# EasyEDA Pro project dual_dcdc_converter.eprj

# Schematic Schematic1
Create Date: 2024-04-01; Page Name: P1; Project Name: dual_dcdc_converter; Schematic Name: Schematic1; Update Date: 2024-04-03; Company: 嘉立创EDA; Page Size: A4; Version: V1.0
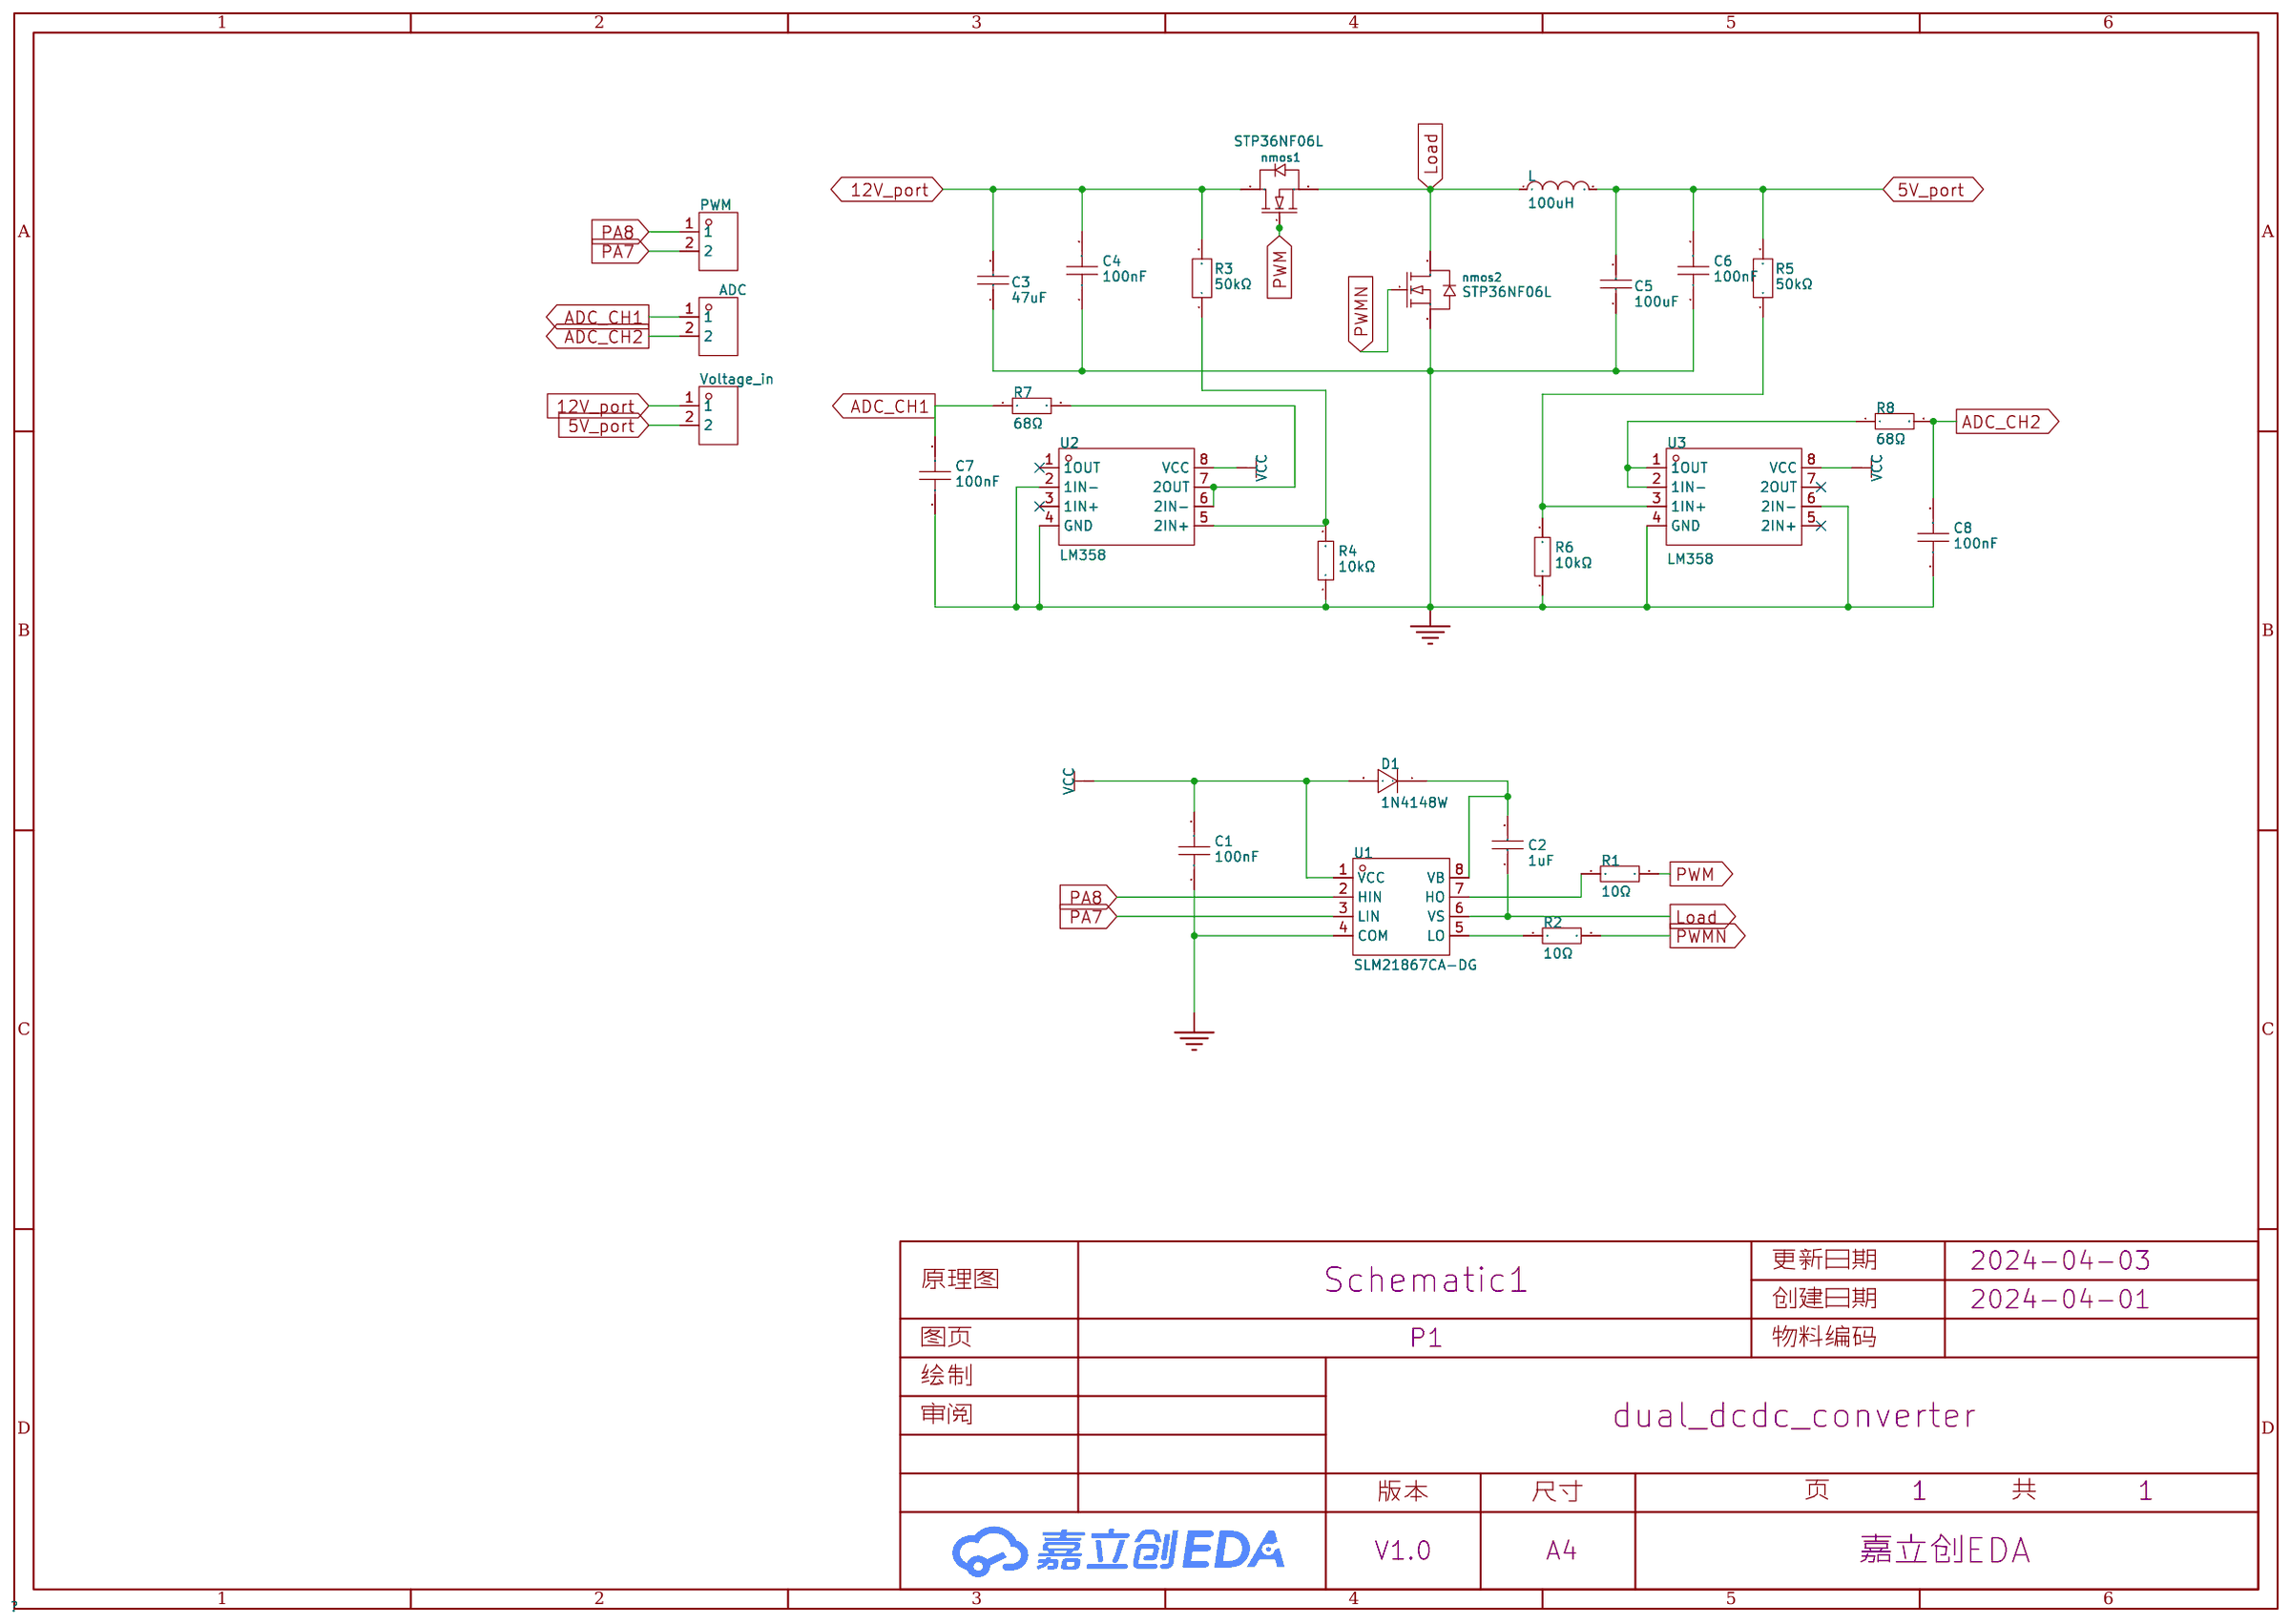
[diagram p0: schematic sheet]

## Parts
ADC  FFH25405-S02S1001K6K  [HDR-TH_2P-P2.54-V-F_FFH25405]
C1  100nF  [C0603]
C2  1uF  [C0805]
C3  47uF  [C0805]
C4  100nF  [C0603]
C5  100uF  [C1206]
C6  100nF  [C0603]
C7  100nF  [C0603]
C8  100nF  [C0603]
D1  1N4148W  [SOD-123F_L2.7-W1.6-LS3.8-RD]
L  100uH  [IND-SMD_L10.5-W10.5]
nmos1  STP36NF06L  [TO-220-3_L10.0-W4.5-P2.54-L]
nmos2  STP36NF06L  [TO-220-3_L10.0-W4.5-P2.54-L]
PWM  FFH25405-S02S1001K6K  [HDR-TH_2P-P2.54-V-F_FFH25405]
R1  10Ω  [R0603]
R2  10Ω  [R0603]
R3  50kΩ  [R0805]
R4  10kΩ  [R0603]
R5  50kΩ  [R0805]
R6  10kΩ  [R0603]
R7  68Ω  [R0805]
R8  68Ω  [R0805]
U1  SLM21867CA-DG  [SOIC-8_L4.9-W3.9-P1.27-LS6.0-BL]
U2  LM358  [SOP-8_L5.0-W4.0-P1.27-LS6.0-BL]
U3  LM358  [SOP-8_L5.0-W4.0-P1.27-LS6.0-BL]
Voltage_in  FFH25405-S02S1001K6K  [HDR-TH_2P-P2.54-V-F_FFH25405]

## Library data of the parts
ADC PWM Voltage_in = FFH25405-S02S1001K6K: 插孔结构:1x2P;间距:2.54mm;行距:-;圆孔/方孔:方孔;安装类型:直插;排数:单排;总孔位数:2P;额定电流:3A;额定电压:250V;插孔方向:顶部;塑高:8.5mm;触头材质:黄铜;触头镀层:金;工作温度范围:-40℃~+105℃;焊接温度(最大值):-;; LCSC Part Name: 间距:2.54mm 1x2P 直插; Supplier Part: C2833813; Manufacturer: TXGA(特思嘉); Supplier Footprint: 插件,P=2.54mm; JLCPCB Part Class: 扩展库; Datasheet: https://atta.szlcsc.com/upload/public/pdf/source/20210518/C2834348_3E59507EAE62B1D66958FABD3A35BA6A.pdf; Supplier: LCSC; Holes Structure: 1x2P; Pitch: 2.54mm; Circular Hole / Square Hole: 方孔; Mounting Type: 直插; Number of Rows: 单排; Number of Holes: 2P; Current Rating (Max): 3A; Voltage Rating (Max): 250V; Holes Direction: 顶部; Insulation Height: 8.5mm; Contact Material: 黄铜; Contact Plating: 金; Operating Temperature Range: -40℃~+105℃
C1 C4 C6-C8 = CC0603KRX7R9BB104: 容值:100nF;精度:±10%;额定电压:50V;材质(温度系数):X7R;; LCSC Part Name: 100nF ±10% 50V; Supplier Part: C14663; Manufacturer: YAGEO(国巨); Supplier Footprint: 0603; JLCPCB Part Class: 基础库; Datasheet: https://atta.szlcsc.com/upload/public/pdf/source/20180910/C282072_33301C7F631E79921B82A8DAC6BCC5B3.pdf; Supplier: LCSC; Tolerance: ±10%; Voltage Rated: 50V; Temperature Coefficient: X7R
C2 = CL21B105KBFNNNE: 容值:1uF;精度:±10%;额定电压:50V;材质(温度系数):X7R;; LCSC Part Name: 1uF ±10% 50V; Supplier Part: C28323; Manufacturer: SAMSUNG(三星); Supplier Footprint: 0805; JLCPCB Part Class: 基础库; Datasheet: https://atta.szlcsc.com/upload/public/pdf/source/20160218/1457707763339.pdf; Supplier: LCSC; Tolerance: ±10%; Voltage Rated: 50V; Temperature Coefficient: X7R
C3 = CL21A476MQYNNNE: 容值:47uF;精度:±20%;额定电压:6.3V;材质(温度系数):X5R;; LCSC Part Name: 47uF ±20% 6.3V; Supplier Part: C16780; Manufacturer: SAMSUNG(三星); Supplier Footprint: 0805; JLCPCB Part Class: 基础库; Datasheet: https://atta.szlcsc.com/upload/public/pdf/source/20160218/1457707763339.pdf; Supplier: LCSC; Tolerance: ±20%; Voltage Rated: 6.3V; Temperature Coefficient: X5R
C5 = CL31A107MQHNNNE: 容值:100uF;精度:±20%;额定电压:6.3V;材质(温度系数):X5R;; LCSC Part Name: 100uF ±20% 6.3V; Supplier Part: C15008; Manufacturer: SAMSUNG(三星); Supplier Footprint: 1206; JLCPCB Part Class: 基础库; Datasheet: https://atta.szlcsc.com/upload/public/pdf/source/20160218/1457707763339.pdf; Supplier: LCSC; Tolerance: ±20%; Voltage Rated: 6.3V; Temperature Coefficient: X5R
D1 = 1N4148W_C81598: 二极管配置:独立式;正向压降(Vf):1V@50mA;直流反向耐压(Vr):75V;平均整流电流(Io):150mA;功率:400mW;反向恢复时间(trr):4ns;; LCSC Part Name: 电压:75V 电流:150mA; Supplier Part: C81598; Manufacturer: ST(先科); Supplier Footprint: SOD-123; JLCPCB Part Class: 基础库; Datasheet: https://atta.szlcsc.com/upload/public/pdf/source/20161024/1477288446905.pdf; Supplier: LCSC; Diode Configuration: 独立式; Forward Voltage (Vf@If): 1V@50mA; Reverse Voltage (Vr): 75V; Average Rectified Current (Io): 150mA; Power Dissipation: 400mW; Reverse Leakage Current: 1uA@75V; Reverse Recovery Time (trr): 4ns
L = CYL104R-100UH: 电感值:100uH;精度:±20%;额定电流:1.35A;直流电阻(DCR):340mΩ;; LCSC Part Name: 100uH ±20%; Supplier Part: C7431102; Manufacturer: SHOU HAN(首韩); Supplier Footprint: SMD,10.5x10.5mm; Datasheet: https://atta.szlcsc.com/upload/public/pdf/source/20230621/086310153CB8CB8D379A424290DF606B.pdf; Supplier: LCSC; Tolerance: ±20%; Rated Current: 1.35A; DC Resistance (DCR): 340mΩ
nmos1 nmos2 = STP36NF06L: 类型:N沟道;漏源电压(Vdss):60V;连续漏极电流(Id):30A;功率(Pd):70W;导通电阻(RDS(on)@Vgs,Id):40mΩ@10V,15A;阈值电压(Vgs(th)@Id):2.5V@250uA;; LCSC Part Name: N沟道 耐压:60V 电流:30A; Supplier Part: C457465; Manufacturer: ST(意法半导体); Supplier Footprint: TO-220; JLCPCB Part Class: 扩展库; Datasheet: https://atta.szlcsc.com/upload/public/pdf/source/20191118/C457465_6E0C63D3C70E3A1F470116ECC1723FFF.pdf; Supplier: LCSC; Type: N沟道; Drain Source Voltage (Vdss): 60V; Continuous Drain Current (Id): 30A; Power Dissipation (Pd): 70W; Drain Source On Resistance (RDS(on)@Vgs,Id): 40mΩ@10V,15A; Gate Threshold Voltage (Vgs(th)@Id): 2.5V@250uA
R1 R2 = 0603WAF100JT5E: 电阻类型:厚膜电阻;阻值:10Ω;精度:±1%;功率:100mW;最大工作电压:75V;温度系数:±400ppm/℃;; LCSC Part Name: 10Ω ±1% 100mW 厚膜电阻; Supplier Part: C22859; Manufacturer: UNI-ROYAL(厚声); Supplier Footprint: 0603; JLCPCB Part Class: 基础库; Datasheet: https://atta.szlcsc.com/upload/public/pdf/source/20200306/C422600_1E6D84923E4A46A82E41ADD87F860B5C.pdf; Supplier: LCSC; Type: 厚膜电阻; Tolerance: ±1%; Power(Watts): 100mW; Overload Voltage (Max): 75V; Temperature Coefficient: ±400ppm/℃; Operating Temperature Range: -55℃~+155℃
R3 R5 = ARG05DTC5002: 电阻类型:薄膜电阻;阻值:50kΩ;精度:±0.5%;功率:125mW;最大工作电压:150V;温度系数:±25ppm/℃;; LCSC Part Name: 薄膜电阻 50kΩ ±0.5% 125mW; Supplier Part: C2828840; Manufacturer: Viking(光颉); Supplier Footprint: 0805; JLCPCB Part Class: 扩展库; Datasheet: https://atta.szlcsc.com/upload/public/pdf/source/20210426/C2828737_35D2DDB0BDDA00747C2712435E28BBD4.pdf; Supplier: LCSC; Type: 薄膜电阻; Tolerance: ±0.5%; Power(Watts): 125mW; Overload Voltage (Max): 150V; Temperature Coefficient: ±25ppm/℃; Operating Temperature Range: -55℃~+155℃
R4 R6 = 0603WAF1002T5E: 电阻类型:厚膜电阻;阻值:10kΩ;精度:±1%;功率:100mW;最大工作电压:75V;温度系数:±100ppm/℃;; LCSC Part Name: 厚膜电阻 10kΩ ±1% 100mW; Supplier Part: C25804; Manufacturer: UNI-ROYAL(厚声); Supplier Footprint: 0603; JLCPCB Part Class: 基础库; Datasheet: https://atta.szlcsc.com/upload/public/pdf/source/20200306/C422600_1E6D84923E4A46A82E41ADD87F860B5C.pdf; Supplier: LCSC; Type: 厚膜电阻; Tolerance: ±1%; Power(Watts): 100mW; Overload Voltage (Max): 75V; Temperature Coefficient: ±100ppm/℃; Operating Temperature Range: -55℃~+155℃
R7 R8 = 0805W8F680JT5E: 电阻类型:厚膜电阻;阻值:68Ω;精度:±1%;功率:125mW;最大工作电压:150V;温度系数:±200ppm/℃;; LCSC Part Name: 68Ω ±1% 125mW 厚膜电阻; Supplier Part: C17802; Manufacturer: UNI-ROYAL(厚声); Supplier Footprint: 0805; JLCPCB Part Class: 扩展库; Datasheet: https://atta.szlcsc.com/upload/public/pdf/source/20200306/C422600_1E6D84923E4A46A82E41ADD87F860B5C.pdf; Supplier: LCSC; Type: 厚膜电阻; Tolerance: ±1%; Power(Watts): 125mW; Overload Voltage (Max): 150V; Temperature Coefficient: ±200ppm/℃; Operating Temperature Range: -55℃~+155℃
U1 = SLM21867CA-DG: 驱动通道数:2;峰值灌电流:2.5A;峰值拉电流:3A;电源电压:7V~20V;是否隔离:非隔离;; Supplier Part: C496627; Manufacturer: Sillumin(数明半导体); Supplier Footprint: SOIC-8; JLCPCB Part Class: 扩展库; Datasheet: https://atta.szlcsc.com/upload/public/pdf/source/20230728/0DAFFB8DA9790BD901FA451FEEF7DDFE.pdf; Supplier: LCSC; Number of Drivers: 2; Peak Output Current(sink): 2.5A; Peak Output Current(source): 3A; Supply Voltage: 7V~20V; Whether the isolation: 非隔离; Operating Temperature: -40℃~+125℃
U2 U3 = LM358: 放大器数:-;输入失调电压(Vos):9V;带宽(-3db):1MHz;; LCSC Part Name: 停产; Supplier Part: C329455; Manufacturer: IDCHIP(英锐芯); Supplier Footprint: SOP-8; JLCPCB Part Class: 扩展库; Datasheet: https://atta.szlcsc.com/upload/public/pdf/source/20190220/C329455_57B3E72C7E5AADCB3F5B4A8F23CFDE4F.pdf; Supplier: LCSC; Voltage - Input Offset(Vos): 9V; Common Mode Rejection Ratio (CMRR): 65dB; Supply Voltage: 3V~30V; -3db Bandwidth: 1MHz

## Nets
5V_port: C5.2 C6.2 L.2 R5.2 Voltage_in.2
12V_port: C3.2 C4.2 nmos1.2(D) R3.2 Voltage_in.1
GND: C1.1 C3.1 C4.1 C5.1 C6.1 C7.1 C8.1 nmos2.3(S) R4.1 R6.1 U1.4(COM) U2.2(1IN-) U2.4(GND) U3.4(GND) U3.6(2IN-)
VCC: C1.2 D1.2(A) U1.1(VCC) U2.8(VCC) U3.8(VCC)
ADC_CH1: ADC.1 C7.2 R7.1
ADC_CH2: ADC.2 C8.2 R8.2
Load: C2.1 L.1 nmos1.3(S) nmos2.2(D) U1.6(VS)
PA7: PWM.2 U1.3(LIN)
PA8: PWM.1 U1.2(HIN)
PWM: nmos1.1(G) R1.2
PWMN: nmos2.1(G) R2.2
$1N970: R2.1 U1.5(LO)
$1N980: R1.1 U1.7(HO)
$1N4335: R7.2 U2.6(2IN-) U2.7(2OUT)
$1N4841: R5.1 R6.2 U3.3(1IN+)
$1N4882: R8.1 U3.1(1OUT) U3.2(1IN-)
$1N5278: C2.2 D1.1(K) U1.8(VB)
$1N8033: R3.1 R4.2 U2.5(2IN+)

Not connected (* = marked no-connect by the designer): U2 1(1OUT)* 3(1IN+)*; U3 5(2IN+)* 7(2OUT)*

# Board PCB2
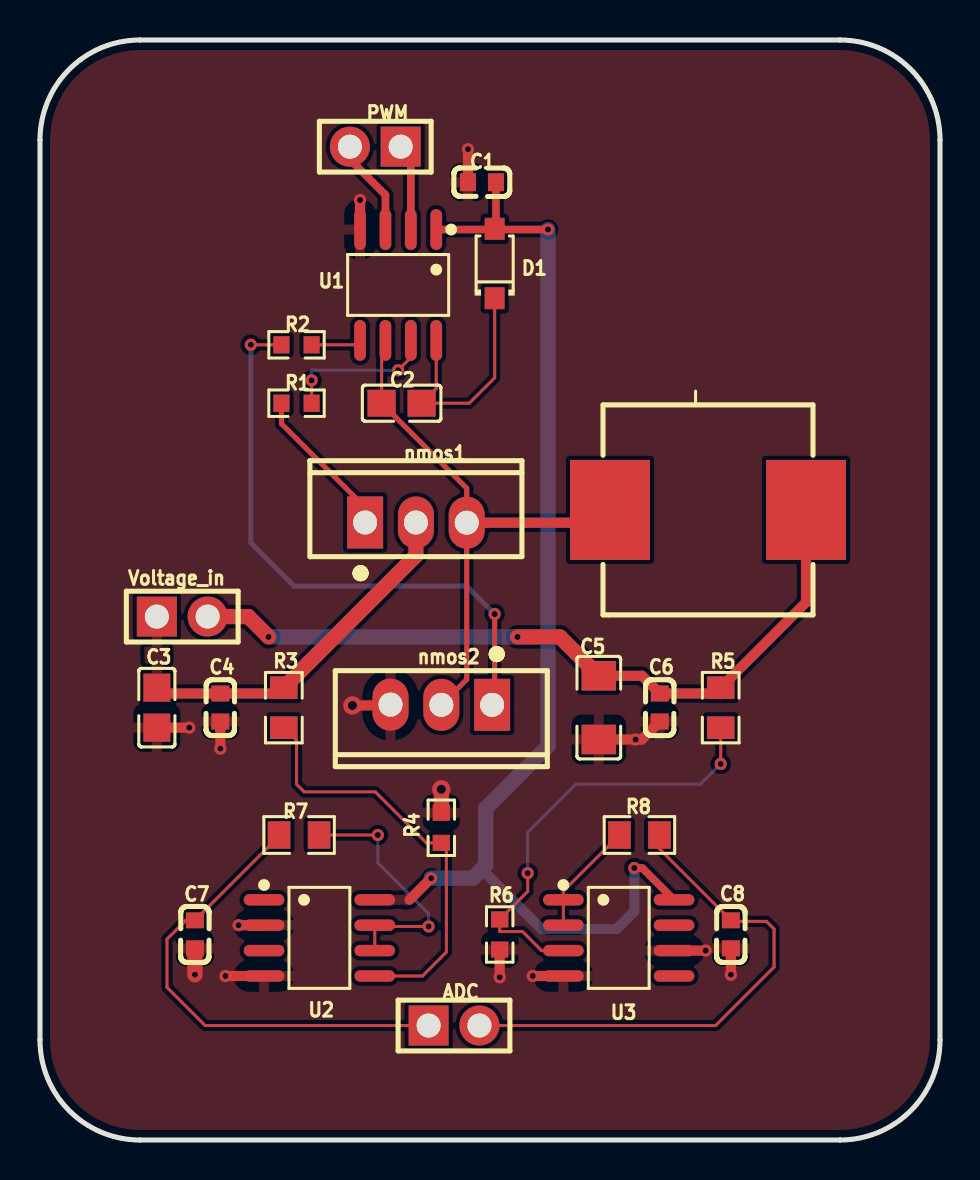
[diagram p1: board, top side]
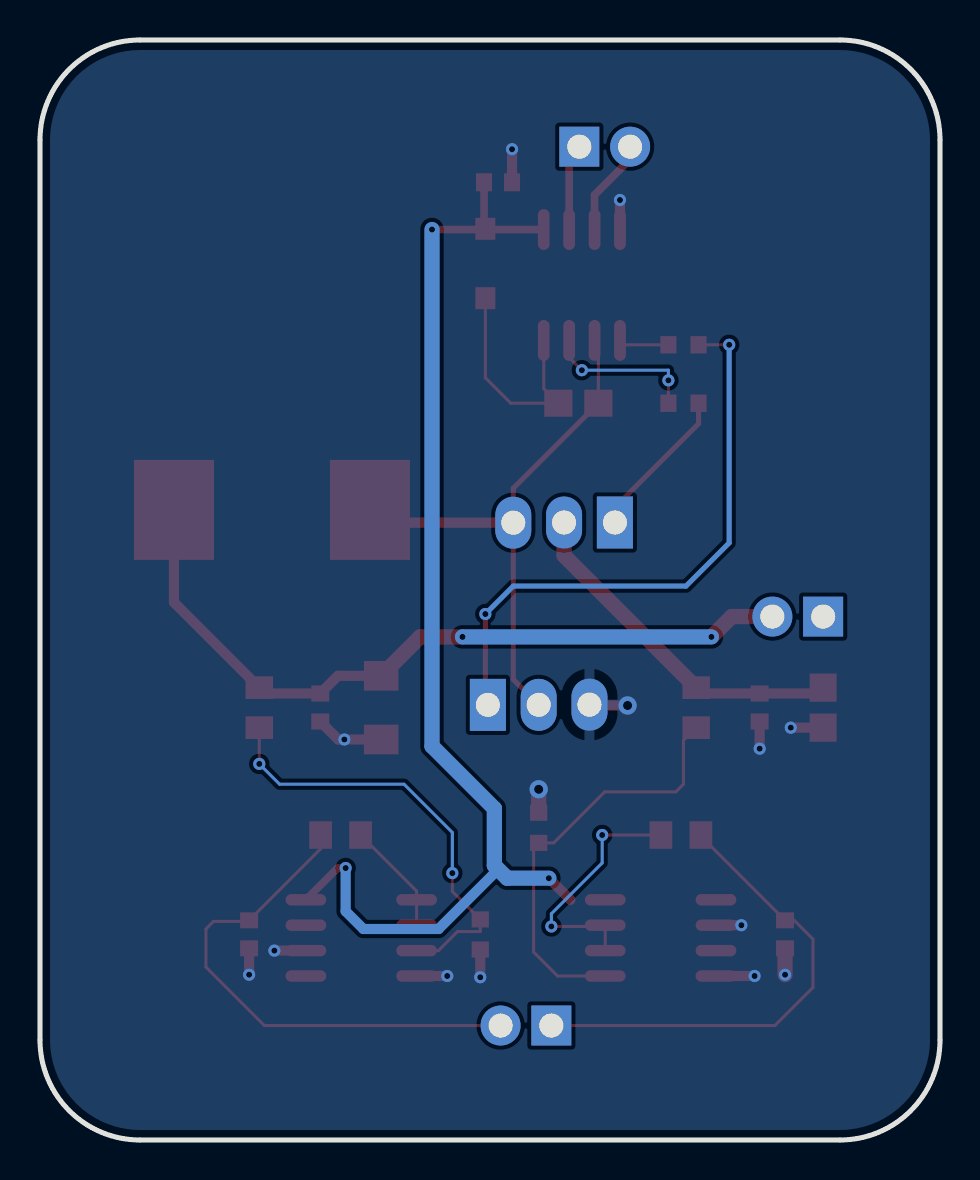
[diagram p2: board, bottom side, seen from below]

Outline 45 x 55 mm; copper layers: Top Layer, Bottom Layer. Coordinates in mm from the lower left corner of the outline.
Outline path: 0,50 0,5 arc(1.46,1.46) 5,0 40,0 arc(43.54,1.46) 45,5 45,50 arc(43.54,53.54) 40,55 5,55 arc(1.46,53.54) 0,50
Stack: Top Layer 0.035mm / Dielectric1 1.51mm FR4 er 4.5 / Bottom Layer 0.035mm

## Design rules (mm)
template: 自定义配置
spacing copperThickness1oz (default): track to track 0.203, other pairs 0.203 to 0.203
spacing copperThickness2oz: track to track 0.203, other pairs 0.152 to 0.3
track width copperThickness1oz (default): min 0.152, default 0.152, max 2.54
track width copperThickness2oz: min 0.203, default 0.254, max 2.54
track width pwr: min 0.508, default 0.762, max 2.54
differential pair differentialPair (default): width min 0.152, default 0.152, max 0.152; gap min 0.152, default 0.152
via viaSize (default): diameter min 0.61, default 0.61, max 2.54; hole min 0.305, default 0.305, max 2.54

## Placement (name value [footprint] x y rotation side)
ADC  FFH25405-S02S1001K6K  [HDR-TH_2P-P2.54-V-F_FFH25405]  20.7 5.72 0 top
C1  100nF  [C0603]  22.1 47.89 0 top
C2  1uF  [C0805]  18.08 36.84 0 top
C3  47uF  [C0805]  5.84 21.62 90 top
C4  100nF  [C0603]  9.02 21.63 90 top
C5  100uF  [C1206]  27.94 21.62 90 top
C6  100nF  [C0603]  30.99 21.63 90 top
C7  100nF  [C0603]  7.75 10.28 90 top
C8  100nF  [C0603]  34.54 10.28 90 top
D1  1N4148W  [SOD-123F_L2.7-W1.6-LS3.8-RD]  22.73 43.82 90 top
L  100uH  [IND-SMD_L10.5-W10.5]  33.4 31.51 0 top
nmos1  STP36NF06L  [TO-220-3_L10.0-W4.5-P2.54-L]  18.8 30.87 0 top
nmos2  STP36NF06L  [TO-220-3_L10.0-W4.5-P2.54-L]  20.07 21.76 180 top
PWM  FFH25405-S02S1001K6K  [HDR-TH_2P-P2.54-V-F_FFH25405]  16.76 49.67 180 top
R1  10Ω  [R0603]  12.83 36.84 180 top
R2  10Ω  [R0603]  12.83 39.76 180 top
R3  50kΩ  [R0805]  12.19 21.62 90 top
R4  10kΩ  [R0603]  20.07 15.61 270 top
R5  50kΩ  [R0805]  34.04 21.62 90 top
R6  10kΩ  [R0603]  22.99 10.28 90 top
R7  68Ω  [R0805]  12.95 15.25 0 top
R8  68Ω  [R0805]  29.97 15.25 0 top
U1  SLM21867CA-DG  [SOIC-8_L4.9-W3.9-P1.27-LS6.0-BL]  17.91 42.75 180 top
U2  LM358  [SOP-8_L5.0-W4.0-P1.27-LS6.0-BL]  13.97 10.11 270 top
U3  LM358  [SOP-8_L5.0-W4.0-P1.27-LS6.0-BL]  28.94 10.11 270 top
Voltage_in  FFH25405-S02S1001K6K  [HDR-TH_2P-P2.54-V-F_FFH25405]  7.11 26.17 0 top

## Footprints (pads in the part's own frame, mm; a bottom-side part is the same pattern mirrored in y, then rotated)
C0603
  rect 0.8x0.9 smd: 1(-0.7,0) 2(0.7,0)
C0805
  rect 1.41x1.35 smd: 1(-1,0) 2(1,0)
C1206
  rect 1.485x1.728 smd: 1(-1.593,0) 2(1.593,0)
HDR-TH_2P-P2.54-V-F_FFH25405
  rect 2x2 hole 1.2: 1(-1.27,0)
  round 2 hole 1.2: 2(1.27,0)
IND-SMD_L10.5-W10.5
  rect 4x5 smd: 1(-4.9,0) 2(4.9,0)
R0603
  rect 0.806x0.864 smd: 1(-0.753,0) 2(0.753,0)
R0805
  rect 1.133x1.377 smd: 1(-1,0) 2(1,0)
SOD-123F_L2.7-W1.6-LS3.8-RD
  rect 1.1x1 smd: 1(-1.735,0) 2(1.735,0)
SOIC-8_L4.9-W3.9-P1.27-LS6.0-BL
  oval 0.588x2.045 smd: 1(-1.905,-2.772) 2(-0.635,-2.772) 3(0.635,-2.772) 4(1.905,-2.772) 5(1.905,2.772) 6(0.635,2.772) 7(-0.635,2.772) 8(-1.905,2.772)
SOP-8_L5.0-W4.0-P1.27-LS6.0-BL
  oval 0.574x2.035 smd: 1(-1.905,-2.768) 2(-0.635,-2.768) 3(0.635,-2.768) 4(1.905,-2.768) 5(1.905,2.768) 6(0.635,2.768) 7(-0.635,2.768) 8(-1.905,2.768)
TO-220-3_L10.0-W4.5-P2.54-L
  rect 1.8x2.6 hole 1.2: 1(-2.54,0.005)
  oval 1.8x2.6 hole 1.2: 2(0,0.005) 3(2.54,-0.005)

## Nets
As in the schematic, except:
5V_PORT: C5.2 C6.2 L.2 R5.2 Voltage_in.2
12V_PORT: C3.2 C4.2 nmos1.2 R3.2 Voltage_in.1
LOAD: C2.1 L.1 nmos1.3 nmos2.2 U1.6

Pads without a net: U2 1 3; U3 5 7

## Via types
v1: diameter 0.61, hole 0.305, Top Layer to Bottom Layer, 25 vias
v2: diameter 0.914, hole 0.457, Top Layer to Bottom Layer, 2 vias

## Routing (per net, layer and track width the routed paths; a pad name or vN(x,y) marks a point on that pad's centre or on a via; arc(x,y) is an arc through that point)
5V_PORT: length 38
  Top Layer w0.508: 38.3,31.51 38.3,26.88 R5.2 33.74,22.33 C6.2 30.1,23.21 C5.2
  Top Layer w0.762: Voltage_in.2 10.41,26.17 v1(11.43,25.16) ; v1(23.88,25.16) 25.99,25.16 C5.2
  Bottom Layer w0.762: v1(11.43,25.16) v1(23.88,25.16)
12V_PORT: length 17.6
  Top Layer w0.508: R3.2 11.9,22.33 C4.2 6.13,22.33 C3.2
  Top Layer w0.762: R3.2 18.8,29.22 nmos1.2
GND: length 23
  Top Layer w0.508: v2(15.62,21.73) 17.48,21.73 nmos2.3 ; C8.1 v1(34.54,8.26) ; R6.1 v1(22.99,8.14) ; C6.1 30.09,20.02 v1(29.78,20.02) C5.1 ; C3.1 v1(7.46,20.62) ; U3.6 v1(33.28,9.47) ; U3.4 v1(24.64,8.2) ; v1(9.93,10.74) U2.2 ; C1.1 v1(21.4,49.54) ; U1.4 v1(16,47) ; U2.4 v1(9.27,8.2) ; C4.1 v1(9.02,19.57)
  Top Layer w0.762: C7.1 v1(7.75,8.26) ; 20.07,16.36 v2(20.07,17.54)
VCC: length 59.7
  Top Layer w0.381: U1.1 22.7,45.52 ; 22.7,45.52 D1.2 22.8,45.62 C1.2 ; 22.7,45.52 v1(25.4,45.52) ; v1(29.72,13.6) 30.12,13.6 U3.8
  Top Layer w0.508: 18.48,12.01 v1(19.56,13.09)
  Bottom Layer w0.508: v1(29.72,13.6) 29.72,11.44 28.83,10.55 25.07,10.55 22.28,13.34 22.28,13.73
  Bottom Layer w0.762: v1(19.56,13.09) 21.64,13.09 22.28,13.73 22.28,16.58 25.4,19.69 v1(25.4,45.52)
ADC_CH1: length 24.1
  Top Layer w0.152: R7.1 11.95,15.19 C7.2 7.29,10.98 6.35,10.04 6.35,7.63 8.25,5.72 19.43,5.72
ADC_CH2: length 25.9
  Top Layer w0.152: R8.2 30.97,14.56 C8.2 34.6,10.93 36.32,10.93 36.7,10.55 36.7,8.65 33.78,5.72 ADC.2
LOAD: length 28
  Top Layer w0.152: U1.6 17.08,39.79 C2.1
  Top Layer w0.254: C2.1 21.34,32.58 nmos1.3 21.34,23.03 nmos2.2
  Top Layer w0.508: nmos1.3 27.86,30.87 L.1
PA7: length 4.9
  Top Layer w0.381: U1.3 17.27,47.25 15.49,49.03 PWM.2
PA8: length 4.4
  Top Layer w0.381: U1.2 18.54,49.16 PWM.1
PWM: length 7.7
  Top Layer w0.254: R1.2 12.07,35.81 16.26,31.63 nmos1.1
PWMN: length 29.6
  Top Layer w0.152: R2.2 10.67,39.76
  Top Layer w0.254: v1(22.73,26.3) 22.73,21.88 nmos2.1
  Bottom Layer w0.254: v1(10.54,39.76) 10.54,29.85 12.7,27.7 21.34,27.7 v1(22.73,26.3)
$1N970: length 2.5
  Top Layer w0.152: R2.1 15.78,39.76 U1.5
$1N980: length 7.7
  Top Layer w0.152: R1.1 v1(13.58,37.98) ; U1.7 18.54,39.13 v1(17.91,38.49)
  Bottom Layer w0.152: v1(17.91,38.49) 13.58,38.49 v1(13.58,37.98)
$1N4335: length 12.6
  Top Layer w0.152: U2.6 U2.7 16.8,10.68 v1(19.43,10.68) ; v1(16.89,15.25) R7.2
  Bottom Layer w0.152: v1(19.43,10.68) 19.43,11.31 16.89,13.85 v1(16.89,15.25)
$1N4841: length 21.9
  Top Layer w0.152: v1(24.38,13.34) 24.38,12.43 R6.2 22.99,10.42 24.12,10.42 25.07,9.47 U3.3 ; R5.1 v1(34.04,18.81)
  Bottom Layer w0.152: 24.38,13.47 24.38,15.38 26.8,17.79 33.02,17.79 v1(34.04,18.81)
$1N4882: length 5.7
  Top Layer w0.152: U3.2 U3.1 26.17,12.45 R8.1
$1N5278: length 11.6
  Top Layer w0.152: U1.8 19.81,37.57 C2.2 21.46,36.84 22.73,38.11 D1.1
$1N8033: length 21.2
  Top Layer w0.152: R3.1 12.83,19.98 12.83,17.79 13.21,17.41 16.76,17.41 19.31,14.86 R4.2 20.32,14.6 20.32,9.4 19.12,8.2 U2.5

## Copper pours and planes (outline as drawn; the poured copper is in the pictures)
12V_PORT on Top Layer: 5.28,21.98 5.21,25.03 4.95,25.28 4.95,25.92 4.83,26.04 6.73,26.04 6.86,25.92 6.86,25.03 6.46,24.63 6.46,21.98
GND on Top Layer: -2.67,58.3 48.39,58.3 48.39,-2.66 -2.67,-2.66
GND on Bottom Layer: -0.76,56.4 46.1,56.4 46.1,-1.64 -0.76,-1.64
VCC on Top Layer: 17.02,12.33 18.46,12.33 18.8,12.58 19,12.25 18.43,11.74 18.16,11.69 17.03,11.69 17.03,12.31
